# EAGLE design SCD4X-Grove (EAGLE 9.6.2)
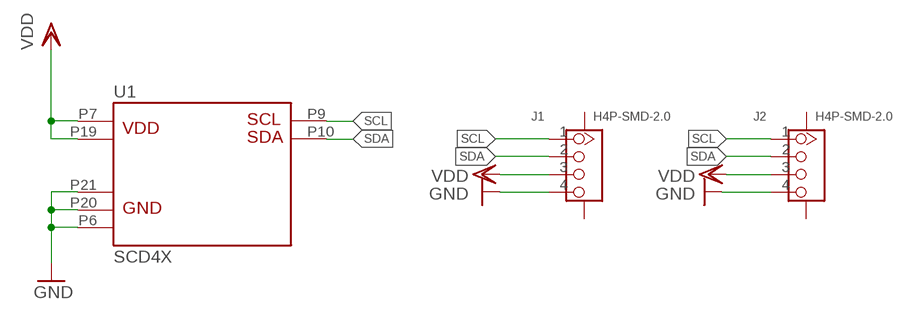
[diagram p0: schematic, sheet 1]

## Parts
J1  H4P-SMD-2.0  GROVE-CONNECTOR-SMD(4+2P-2.0)  [HW4-SMD-2.0]
J2  H4P-SMD-2.0  GROVE-CONNECTOR-SMD(4+2P-2.0)  [HW4-SMD-2.0]
U1  SCD4X  [SCD4X]

## Nets
GND: J1.4 J2.4 U1.P6 U1.P20 U1.P21
SCL: J1.1 J2.1 U1.P9
SDA: J1.2 J2.2 U1.P10
VDD: J1.3 J2.3 U1.P7 U1.P19
Unconnected: J1.SS1 J1.SS2 J2.SS1 J2.SS2 U1.P1 U1.P2 U1.P3 U1.P4 U1.P5 U1.P8 U1.P11 U1.P12 U1.P13 U1.P14 U1.P15 U1.P16 U1.P17 U1.P18

## Library data of the parts
J1 J2 = OPL_Connector:GROVE-CONNECTOR-SMD(4+2P-2.0): 320110030
U1 = Sensirion-Sensors:SCD4X

## Board
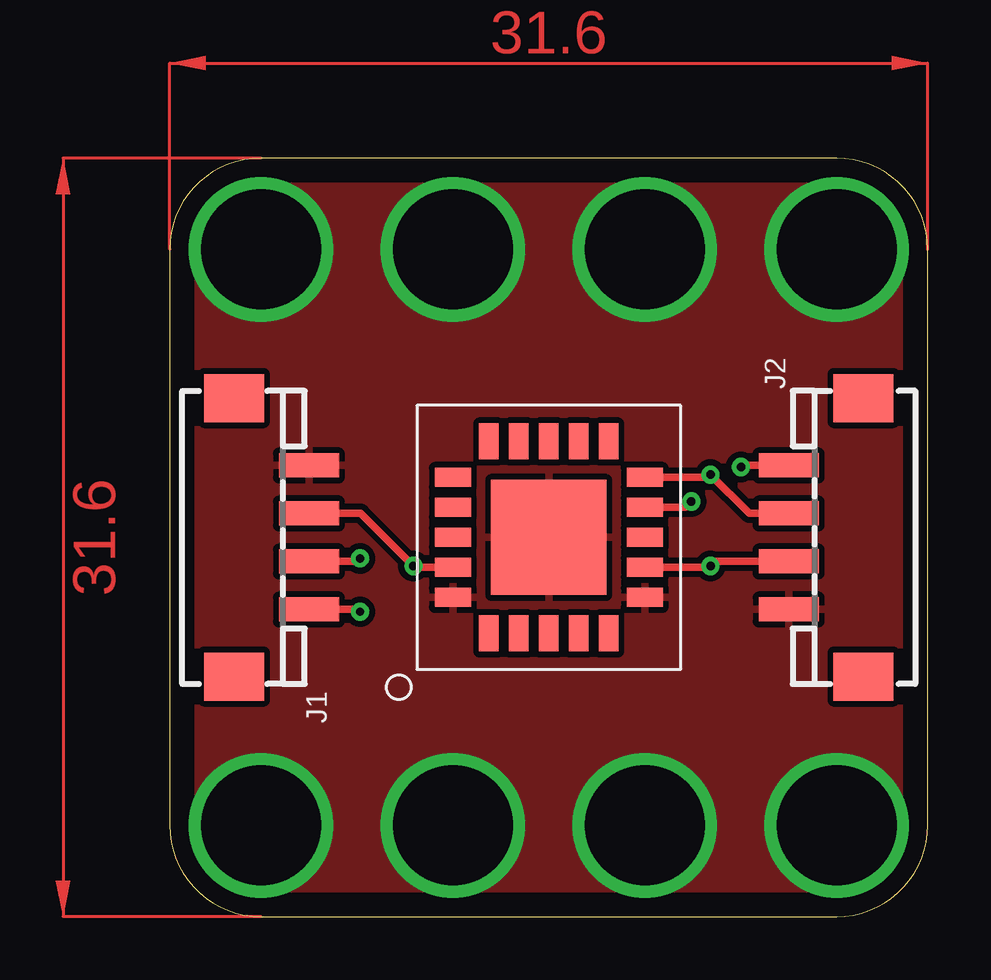
[diagram p1: board, top side]
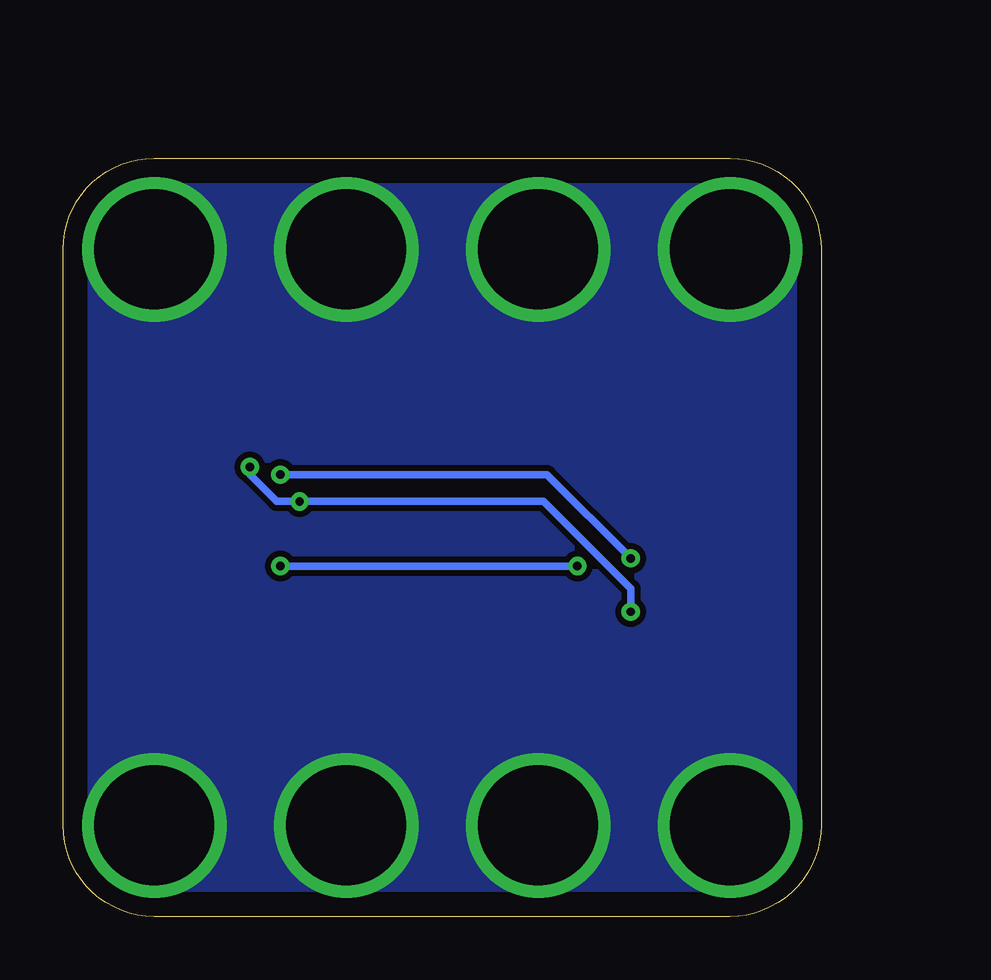
[diagram p2: board, bottom side, seen from below]

Size 31.6 x 31.6 mm. Coordinates in mm from the lower left corner, seen from the top.
Outline: 0,3.8 arc90 3.8,0 27.8,0 arc90 31.6,3.8 31.6,27.8 arc90 27.8,31.6 3.8,31.6 arc90 0,27.8 0,3.8
Copper layers (1*16): Top 0.035mm / dielectric 1.5mm / Bottom 0.035mm
Design rules "default": minimum track width 6mil, minimum drill 0.35mm, track to track 6mil, track to pad 6mil, pad to pad 6mil, via to via 6mil, smd to smd 6mil, copper to edge 40mil, drill to drill 6mil, minimum pad ring 10mil, minimum via ring 8mil, stop-mask expansion 4mil, vias tented up to drill 0mil, thermal gap 10mil

### Footprints (pad centres in the part's own frame; a part is rotated, then mirrored left to right if it is on the bottom)
HW4-SMD-2.0 = smd 1 x 2.5: 1 -3,0; 2 -1,0; 3 1,0; 4 3,0 | smd 2 x 2.5: SS1 -5.8,3.123; SS2 5.8,3.123
SCD4X = smd 1.5 x 0.8: P1 -4,2.5; P2 -4,1.25; P3 -4,0; P4 -4,-1.25; P5 -4,-2.5; P11 4,-2.5; P12 4,-1.25; P13 4,0; P14 4,1.25; P15 4,2.5 | smd 0.8 x 1.5: P6 -2.5,-4; P7 -1.25,-4; P8 0,-4; P9 1.25,-4; P10 2.5,-4; P16 2.5,4; P17 1.25,4; P18 0,4; P19 -1.25,4; P20 -2.5,4 | smd 4.8 x 4.8: P21 0,0

### Placement (x,y rotation side)
J1  5.8,15.8 90 top
J2  25.8,15.8 270 top
U1  15.8,15.8 90 top

### Tracks (layer width: path | path; a pad name or v marks a point on that pad's centre or on a via)
GND  (via drill 5)
  other vias: 3.8,3.8 3.8,27.8 27.8,27.8 27.8,3.8 11.8,3.8 19.8,3.8 11.8,27.8 19.8,27.8
  pour Top (isolate 0.254): 0,0 31.75,0 31.75,6.99 31.75,31.75 1.59,31.75 0,31.75
  pour Bottom (isolate 0.254): 0,0 31.75,0 31.75,31.43 31.75,31.75 1.91,31.75 0,31.75
SCL  (via drill 0.35)
  Top 0.305: U1.P9 21.5,17.05 v21.74,17.3 | J1.1 7.84,12.8 v7.94,12.7 | J2.1 23.88,18.8 v23.81,18.73
  Bottom 0.305: v7.94,12.7 7.94,13.65 11.58,17.3 v21.74,17.3 v21.75,17.3 22.7,17.3 23.81,18.41 v23.81,18.73
SDA  (via drill 0.35)
  Top 0.305: U1.P10 22.43,18.3 v22.54,18.41 24.16,16.8 J2.2 | J1.2 7.82,14.8 v7.94,14.92
  Bottom 0.305: v22.54,18.41 11.43,18.41 v7.94,14.92
VDD  (via drill 0.35)
  Top 0.305: J1.3 7.96,16.8 v10.16,14.61 10.21,14.55 U1.P19 | J2.3 22.74,14.8 v22.54,14.61 22.49,14.55 U1.P7
  Bottom 0.305: v22.54,14.61 v10.16,14.61
(copper drawn outside any net)
  shapes: Top area x2

### Text on the board
200bmp: /Users/joern/Documents/Dokumente - Jørns MacBook Pro/Workspace/Calliope/Sensirion/Sensirion/Calliope_SCD40/info4.bmp